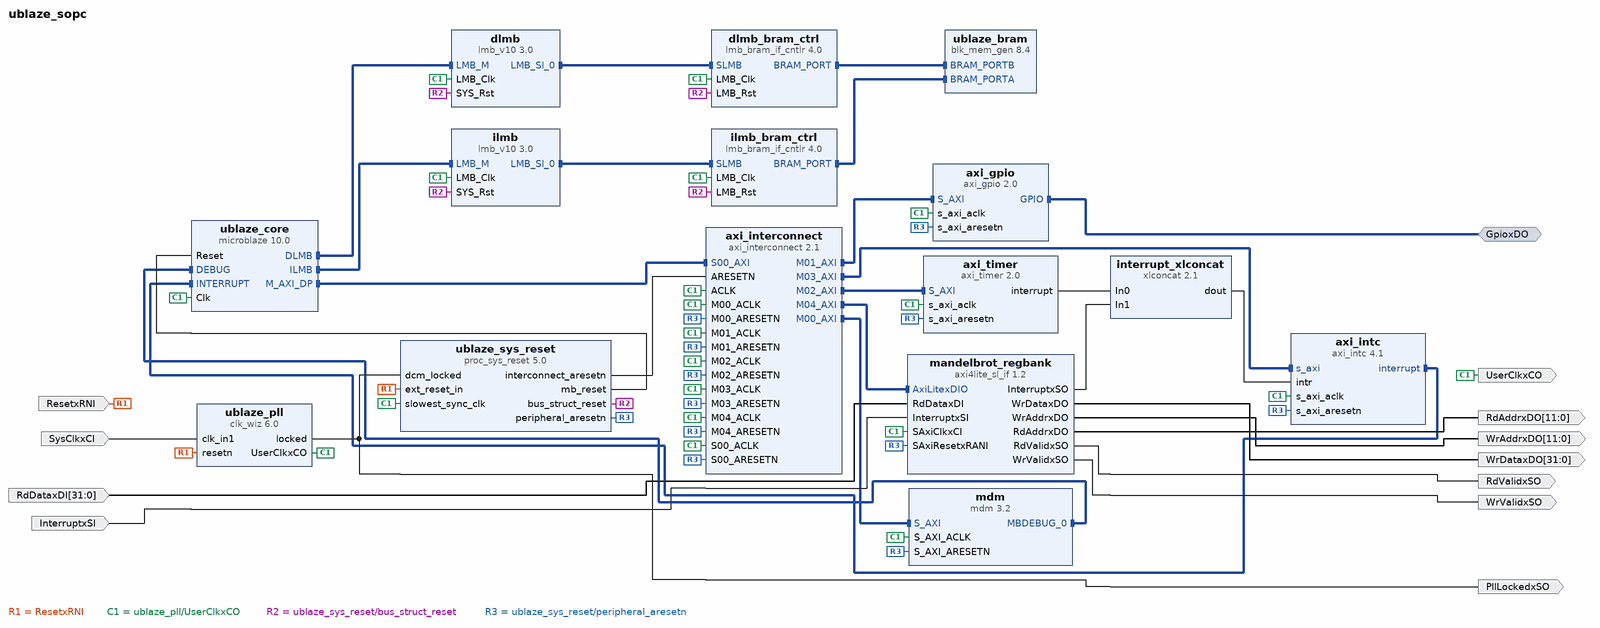
[diagram p0: block diagram of the top level]
# Vivado block design ublaze_sopc, xc7a200tsbg484-1, Vivado 2018.2.2
create_bd_design ublaze_sopc

create_bd_intf_port -mode Master -vlnv xilinx.com:interface:gpio_rtl:1.0 GpioxDO
create_bd_port -dir I -type rst ResetxRNI
create_bd_port -dir I -type clk SysClkxCI
create_bd_port -dir O -type clk UserClkxCO
create_bd_port -dir O PllLockedxSO
create_bd_port -dir O -from 31 -to 0 WrDataxDO
create_bd_port -dir O -from 11 -to 0 WrAddrxDO
create_bd_port -dir O WrValidxSO
create_bd_port -dir I -from 31 -to 0 RdDataxDI
create_bd_port -dir O -from 11 -to 0 RdAddrxDO
create_bd_port -dir O RdValidxSO
create_bd_port -dir I -type intr InterruptxSI

create_bd_cell -type ip -vlnv xilinx.com:ip:microblaze:10.0 ublaze_core
set_property -dict {CONFIG.C_D_AXI 1} [get_bd_cells ublaze_core]
create_bd_cell -type ip -vlnv xilinx.com:ip:clk_wiz:6.0 ublaze_pll
set_property -dict [list \
  CONFIG.CLK_OUT1_PORT UserClkxCO \
  CONFIG.CLKOUT1_REQUESTED_OUT_FREQ 50 \
  CONFIG.RESET_PORT resetn \
  CONFIG.MMCM_DIVCLK_DIVIDE 1 \
  CONFIG.MMCM_CLKOUT0_DIVIDE_F 20.000 \
  CONFIG.RESET_TYPE ACTIVE_LOW \
  CONFIG.CLKOUT1_JITTER 151.636 \
] [get_bd_cells ublaze_pll]
create_bd_cell -type ip -vlnv xilinx.com:ip:proc_sys_reset:5.0 ublaze_sys_reset
create_bd_cell -type ip -vlnv xilinx.com:ip:lmb_v10:3.0 ilmb
create_bd_cell -type ip -vlnv xilinx.com:ip:lmb_v10:3.0 dlmb
create_bd_cell -type ip -vlnv xilinx.com:ip:lmb_bram_if_cntlr:4.0 dlmb_bram_ctrl
create_bd_cell -type ip -vlnv xilinx.com:ip:blk_mem_gen:8.4 ublaze_bram
set_property -dict [list \
  CONFIG.Memory_Type True_Dual_Port_RAM \
  CONFIG.Enable_B Use_ENB_Pin \
  CONFIG.Use_RSTB_Pin true \
  CONFIG.Port_B_Clock 100 \
  CONFIG.Port_B_Write_Rate 50 \
  CONFIG.Port_B_Enable_Rate 100 \
  CONFIG.EN_SAFETY_CKT false \
] [get_bd_cells ublaze_bram]
create_bd_cell -type ip -vlnv xilinx.com:ip:lmb_bram_if_cntlr:4.0 ilmb_bram_ctrl
create_bd_cell -type ip -vlnv xilinx.com:ip:axi_interconnect:2.1 axi_interconnect
set_property -dict {CONFIG.NUM_SI 1 CONFIG.NUM_MI 5} [get_bd_cells axi_interconnect]
create_bd_cell -type ip -vlnv xilinx.com:ip:mdm:3.2 mdm
set_property -dict {CONFIG.C_USE_UART 1} [get_bd_cells mdm]
create_bd_cell -type ip -vlnv xilinx.com:ip:axi_gpio:2.0 axi_gpio
set_property -dict {CONFIG.C_GPIO_WIDTH 8 CONFIG.C_ALL_OUTPUTS 1} [get_bd_cells axi_gpio]
create_bd_cell -type ip -vlnv xilinx.com:ip:axi_timer:2.0 axi_timer
create_bd_cell -type ip -vlnv xilinx.com:ip:axi_intc:4.1 axi_intc
create_bd_cell -type ip -vlnv xilinx.com:ip:xlconcat:2.1 interrupt_xlconcat
create_bd_cell -type ip -vlnv hepia.hesge.ch:user:axi4lite_sl_if:1.2 mandelbrot_regbank

# ---- connections ----

connect_bd_intf_net [get_bd_intf_pins dlmb/LMB_Sl_0] [get_bd_intf_pins dlmb_bram_ctrl/SLMB]
connect_bd_intf_net [get_bd_intf_pins ilmb/LMB_Sl_0] [get_bd_intf_pins ilmb_bram_ctrl/SLMB]
connect_bd_intf_net [get_bd_intf_pins ilmb_bram_ctrl/BRAM_PORT] [get_bd_intf_pins ublaze_bram/BRAM_PORTA]
connect_bd_intf_net [get_bd_intf_pins dlmb_bram_ctrl/BRAM_PORT] [get_bd_intf_pins ublaze_bram/BRAM_PORTB]
connect_bd_intf_net -intf_net microblaze_0_DLMB [get_bd_intf_pins ublaze_core/DLMB] [get_bd_intf_pins dlmb/LMB_M]
connect_bd_intf_net -intf_net microblaze_0_ILMB [get_bd_intf_pins ublaze_core/ILMB] [get_bd_intf_pins ilmb/LMB_M]
connect_bd_intf_net [get_bd_intf_pins axi_interconnect/S00_AXI] [get_bd_intf_pins ublaze_core/M_AXI_DP]
connect_bd_intf_net [get_bd_intf_pins mdm/MBDEBUG_0] [get_bd_intf_pins ublaze_core/DEBUG]
connect_bd_intf_net [get_bd_intf_pins mdm/S_AXI] [get_bd_intf_pins axi_interconnect/M00_AXI]
connect_bd_intf_net [get_bd_intf_pins axi_gpio/S_AXI] [get_bd_intf_pins axi_interconnect/M01_AXI]
connect_bd_intf_net [get_bd_intf_pins axi_timer/S_AXI] [get_bd_intf_pins axi_interconnect/M02_AXI]
connect_bd_intf_net [get_bd_intf_pins axi_interconnect/M03_AXI] [get_bd_intf_pins axi_intc/s_axi]
connect_bd_intf_net [get_bd_intf_pins axi_intc/interrupt] [get_bd_intf_pins ublaze_core/INTERRUPT]
connect_bd_intf_net [get_bd_intf_pins axi_interconnect/M04_AXI] [get_bd_intf_pins mandelbrot_regbank/AxiLitexDIO]
connect_bd_intf_net [get_bd_intf_ports GpioxDO] [get_bd_intf_pins axi_gpio/GPIO]
connect_bd_net -net resetn_0_1 [get_bd_ports ResetxRNI] [get_bd_pins ublaze_pll/resetn] [get_bd_pins ublaze_sys_reset/ext_reset_in]
connect_bd_net -net clk_in1_0_1 [get_bd_ports SysClkxCI] [get_bd_pins ublaze_pll/clk_in1]
connect_bd_net -net proc_sys_reset_0_mb_reset [get_bd_pins ublaze_sys_reset/mb_reset] [get_bd_pins ublaze_core/Reset]
connect_bd_net -net clk_wiz_0_UserClkxCO [get_bd_pins ublaze_pll/UserClkxCO] \
  [get_bd_ports UserClkxCO] [get_bd_pins ublaze_sys_reset/slowest_sync_clk] [get_bd_pins ublaze_core/Clk] \
  [get_bd_pins dlmb/LMB_Clk] [get_bd_pins ilmb/LMB_Clk] [get_bd_pins ilmb_bram_ctrl/LMB_Clk] \
  [get_bd_pins dlmb_bram_ctrl/LMB_Clk] [get_bd_pins mdm/S_AXI_ACLK] [get_bd_pins axi_gpio/s_axi_aclk] \
  [get_bd_pins axi_timer/s_axi_aclk] [get_bd_pins axi_intc/s_axi_aclk] [get_bd_pins axi_interconnect/ACLK] \
  [get_bd_pins axi_interconnect/S00_ACLK] [get_bd_pins axi_interconnect/M00_ACLK] [get_bd_pins axi_interconnect/M01_ACLK] \
  [get_bd_pins axi_interconnect/M02_ACLK] [get_bd_pins axi_interconnect/M03_ACLK] [get_bd_pins axi_interconnect/M04_ACLK] \
  [get_bd_pins mandelbrot_regbank/SAxiClkxCI]
connect_bd_net -net clk_wiz_0_locked [get_bd_pins ublaze_pll/locked] [get_bd_ports PllLockedxSO] [get_bd_pins ublaze_sys_reset/dcm_locked]
connect_bd_net -net proc_sys_reset_0_bus_struct_reset [get_bd_pins ublaze_sys_reset/bus_struct_reset] \
  [get_bd_pins dlmb/SYS_Rst] [get_bd_pins ilmb/SYS_Rst] [get_bd_pins ilmb_bram_ctrl/LMB_Rst] \
  [get_bd_pins dlmb_bram_ctrl/LMB_Rst]
connect_bd_net -net ARESETN_1 [get_bd_pins ublaze_sys_reset/interconnect_aresetn] [get_bd_pins axi_interconnect/ARESETN]
connect_bd_net -net S00_ARESETN_1 [get_bd_pins ublaze_sys_reset/peripheral_aresetn] \
  [get_bd_pins mdm/S_AXI_ARESETN] [get_bd_pins axi_gpio/s_axi_aresetn] [get_bd_pins axi_timer/s_axi_aresetn] \
  [get_bd_pins axi_intc/s_axi_aresetn] [get_bd_pins axi_interconnect/S00_ARESETN] [get_bd_pins axi_interconnect/M00_ARESETN] \
  [get_bd_pins axi_interconnect/M01_ARESETN] [get_bd_pins axi_interconnect/M02_ARESETN] \
  [get_bd_pins axi_interconnect/M03_ARESETN] [get_bd_pins axi_interconnect/M04_ARESETN] \
  [get_bd_pins mandelbrot_regbank/SAxiResetxRANI]
connect_bd_net [get_bd_pins interrupt_xlconcat/dout] [get_bd_pins axi_intc/intr]
connect_bd_net [get_bd_pins axi_timer/interrupt] [get_bd_pins interrupt_xlconcat/In0]
connect_bd_net -net axi4lite_sl_if_0_InterruptxSO [get_bd_pins mandelbrot_regbank/InterruptxSO] [get_bd_pins interrupt_xlconcat/In1]
connect_bd_net -net axi4lite_sl_if_0_WrDataxDO [get_bd_pins mandelbrot_regbank/WrDataxDO] [get_bd_ports WrDataxDO]
connect_bd_net -net axi4lite_sl_if_0_WrAddrxDO [get_bd_pins mandelbrot_regbank/WrAddrxDO] [get_bd_ports WrAddrxDO]
connect_bd_net -net axi4lite_sl_if_0_WrValidxSO [get_bd_pins mandelbrot_regbank/WrValidxSO] [get_bd_ports WrValidxSO]
connect_bd_net -net RdDataxDI_0_1 [get_bd_ports RdDataxDI] [get_bd_pins mandelbrot_regbank/RdDataxDI]
connect_bd_net -net axi4lite_sl_if_0_RdAddrxDO [get_bd_pins mandelbrot_regbank/RdAddrxDO] [get_bd_ports RdAddrxDO]
connect_bd_net -net axi4lite_sl_if_0_RdValidxSO [get_bd_pins mandelbrot_regbank/RdValidxSO] [get_bd_ports RdValidxSO]
connect_bd_net -net InterruptxSI_0_1 [get_bd_ports InterruptxSI] [get_bd_pins mandelbrot_regbank/InterruptxSI]

# ---- address map ----
assign_bd_address -offset 0x00000000 -range 32K -target_address_space [get_bd_addr_spaces ublaze_core/Data] [get_bd_addr_segs dlmb_bram_ctrl/SLMB/Mem]
assign_bd_address -offset 0x40000000 -range 64K -target_address_space [get_bd_addr_spaces ublaze_core/Data] [get_bd_addr_segs axi_gpio/S_AXI/Reg]
assign_bd_address -offset 0x41200000 -range 64K -target_address_space [get_bd_addr_spaces ublaze_core/Data] [get_bd_addr_segs axi_intc/S_AXI/Reg]
assign_bd_address -offset 0x41400000 -range 4K -target_address_space [get_bd_addr_spaces ublaze_core/Data] [get_bd_addr_segs mdm/S_AXI/Reg]
assign_bd_address -offset 0x41C00000 -range 64K -target_address_space [get_bd_addr_spaces ublaze_core/Data] [get_bd_addr_segs axi_timer/S_AXI/Reg]
assign_bd_address -offset 0x44A00000 -range 4K -target_address_space [get_bd_addr_spaces ublaze_core/Data] [get_bd_addr_segs mandelbrot_regbank/AxiLitexDIO/Reg]
assign_bd_address -offset 0x00000000 -range 32K -target_address_space [get_bd_addr_spaces ublaze_core/Instruction] [get_bd_addr_segs ilmb_bram_ctrl/SLMB/Mem]

validate_bd_design
save_bd_design
